# EAGLE schematic schema (EAGLE 9.5.2)
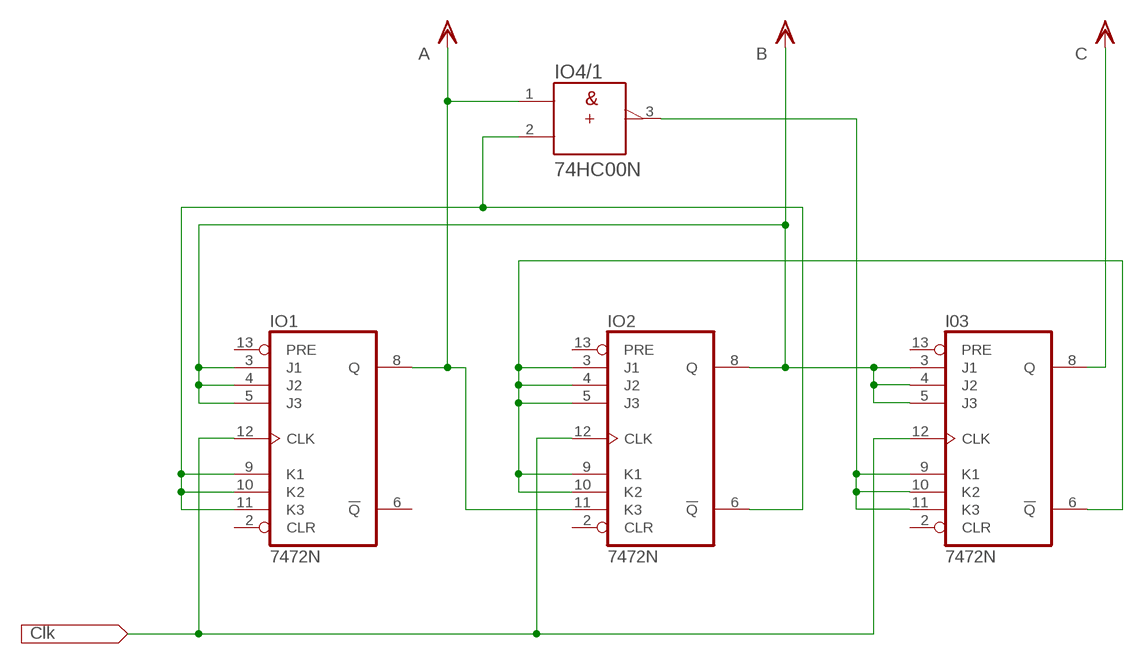
[diagram p0: schematic, sheet 1]

## Parts
I03  7472N  [DIL14]
IO1  7472N  [DIL14]
IO2  7472N  [DIL14]
IO4  74HC00N  [DIL14]

## Nets
N$1: I03.12(CLK) IO1.12(CLK) IO2.12(CLK)
N$2: I03.6(!Q) IO2.3(J1) IO2.4(J2) IO2.5(J3) IO2.9(K1) IO2.10(K2)
N$5: IO1.9(K1) IO1.10(K2) IO1.11(K3) IO2.6(!Q) IO4.2(/1:B)
N$6: I03.9(K1) I03.10(K2) I03.11(K3) IO4.3(/1:Y)
VDD: I03.3(J1) I03.4(J2) I03.5(J3) I03.8(Q) IO1.3(J1) IO1.4(J2) IO1.5(J3) IO1.8(Q) IO2.8(Q) IO2.11(K3) IO4.1(/1:A) ; supply symbol labelled A, B, C
Unconnected: I03.2(CLR) I03.13(PRE) IO1.2(CLR) IO1.6(!Q) IO1.13(PRE) IO2.2(CLR) IO2.13(PRE) IO4.4(/2:A) IO4.5(/2:B) IO4.6(/2:Y) IO4.8(/3:Y) IO4.9(/3:A) IO4.10(/3:B) IO4.11(/4:Y) IO4.12(/4:A) IO4.13(/4:B)

## Power pins joined to a net without a drawn wire
+UB: IO4.14(/+UB:+UB)
-UB: IO4.7(/-UB:-UB)
GND: I03.7(GND) IO1.7(GND) IO2.7(GND)
VCC: I03.14(VCC) IO1.14(VCC) IO2.14(VCC)

## Library data of the parts
I03 IO1 IO2 = 74xx-eu:74*72: AND gated J-K master slave FLIP FLOP, preset and clear
IO4 = 74ttl-din:74*00: Quad 2-input NAND gate